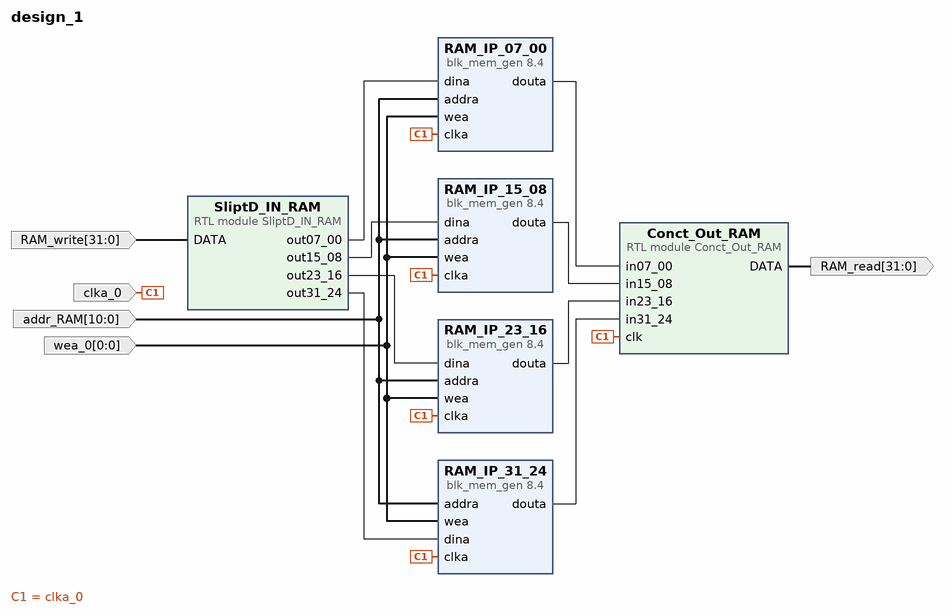
[diagram p0: block diagram of the top level]
# Vivado block design design_1, xc7z010clg400-1, Vivado 2023.2
create_bd_design design_1

create_bd_port -dir I -from 31 -to 0 RAM_write
create_bd_port -dir O -from 31 -to 0 RAM_read
create_bd_port -dir I -from 0 -to 0 wea_0
create_bd_port -dir I -type clk clka_0
create_bd_port -dir I -from 10 -to 0 addr_RAM

create_bd_cell -type module -reference Conct_Out_RAM Conct_Out_RAM
create_bd_cell -type ip -vlnv xilinx.com:ip:blk_mem_gen:8.4 RAM_IP_07_00
set_property -dict [list \
  CONFIG.Enable_32bit_Address false \
  CONFIG.Enable_A Always_Enabled \
  CONFIG.Fill_Remaining_Memory_Locations true \
  CONFIG.Operating_Mode_A READ_FIRST \
  CONFIG.Read_Width_A 8 \
  CONFIG.Register_PortA_Output_of_Memory_Primitives false \
  CONFIG.Use_Byte_Write_Enable false \
  CONFIG.Use_RSTA_Pin false \
  CONFIG.Write_Depth_A 2048 \
  CONFIG.Write_Width_A 8 \
  CONFIG.use_bram_block Stand_Alone \
] [get_bd_cells RAM_IP_07_00]
create_bd_cell -type ip -vlnv xilinx.com:ip:blk_mem_gen:8.4 RAM_IP_23_16
set_property -dict [list \
  CONFIG.Enable_32bit_Address false \
  CONFIG.Enable_A Always_Enabled \
  CONFIG.Fill_Remaining_Memory_Locations true \
  CONFIG.Operating_Mode_A READ_FIRST \
  CONFIG.Read_Width_A 8 \
  CONFIG.Register_PortA_Output_of_Memory_Primitives false \
  CONFIG.Use_Byte_Write_Enable false \
  CONFIG.Use_RSTA_Pin false \
  CONFIG.Write_Depth_A 2048 \
  CONFIG.Write_Width_A 8 \
  CONFIG.use_bram_block Stand_Alone \
] [get_bd_cells RAM_IP_23_16]
create_bd_cell -type ip -vlnv xilinx.com:ip:blk_mem_gen:8.4 RAM_IP_15_08
set_property -dict [list \
  CONFIG.Enable_32bit_Address false \
  CONFIG.Enable_A Always_Enabled \
  CONFIG.Fill_Remaining_Memory_Locations true \
  CONFIG.Operating_Mode_A READ_FIRST \
  CONFIG.Read_Width_A 8 \
  CONFIG.Register_PortA_Output_of_Memory_Primitives false \
  CONFIG.Use_Byte_Write_Enable false \
  CONFIG.Use_RSTA_Pin false \
  CONFIG.Write_Depth_A 2048 \
  CONFIG.Write_Width_A 8 \
  CONFIG.use_bram_block Stand_Alone \
] [get_bd_cells RAM_IP_15_08]
create_bd_cell -type ip -vlnv xilinx.com:ip:blk_mem_gen:8.4 RAM_IP_31_24
set_property -dict [list \
  CONFIG.Enable_32bit_Address false \
  CONFIG.Enable_A Always_Enabled \
  CONFIG.Fill_Remaining_Memory_Locations true \
  CONFIG.Operating_Mode_A READ_FIRST \
  CONFIG.Read_Width_A 8 \
  CONFIG.Register_PortA_Output_of_Memory_Primitives false \
  CONFIG.Use_Byte_Write_Enable false \
  CONFIG.Use_RSTA_Pin false \
  CONFIG.Write_Depth_A 2048 \
  CONFIG.Write_Width_A 8 \
  CONFIG.use_bram_block Stand_Alone \
] [get_bd_cells RAM_IP_31_24]
create_bd_cell -type module -reference SliptD_IN_RAM SliptD_IN_RAM

# ---- connections ----

connect_bd_net -net Conct_Out_RAM_0_DATA [get_bd_pins Conct_Out_RAM/DATA] [get_bd_ports RAM_read]
connect_bd_net -net DATA_1_1 [get_bd_ports RAM_write] [get_bd_pins SliptD_IN_RAM/DATA]
connect_bd_net [get_bd_pins RAM_IP_07_00/douta] [get_bd_pins Conct_Out_RAM/in07_00]
connect_bd_net [get_bd_pins RAM_IP_15_08/douta] [get_bd_pins Conct_Out_RAM/in15_08]
connect_bd_net [get_bd_pins RAM_IP_23_16/douta] [get_bd_pins Conct_Out_RAM/in23_16]
connect_bd_net [get_bd_pins RAM_IP_31_24/douta] [get_bd_pins Conct_Out_RAM/in31_24]
connect_bd_net -net SliptD_IN_RAM_0_out07_00 [get_bd_pins SliptD_IN_RAM/out07_00] [get_bd_pins RAM_IP_07_00/dina]
connect_bd_net -net SliptD_IN_RAM_0_out15_08 [get_bd_pins SliptD_IN_RAM/out15_08] [get_bd_pins RAM_IP_15_08/dina]
connect_bd_net -net SliptD_IN_RAM_0_out23_16 [get_bd_pins SliptD_IN_RAM/out23_16] [get_bd_pins RAM_IP_23_16/dina]
connect_bd_net -net SliptD_IN_RAM_0_out31_24 [get_bd_pins SliptD_IN_RAM/out31_24] [get_bd_pins RAM_IP_31_24/dina]
connect_bd_net -net addra_0_2 [get_bd_ports addr_RAM] \
  [get_bd_pins RAM_IP_07_00/addra] [get_bd_pins RAM_IP_23_16/addra] [get_bd_pins RAM_IP_15_08/addra] \
  [get_bd_pins RAM_IP_31_24/addra]
connect_bd_net -net clka_0_2 [get_bd_ports clka_0] \
  [get_bd_pins RAM_IP_07_00/clka] [get_bd_pins RAM_IP_23_16/clka] [get_bd_pins RAM_IP_15_08/clka] \
  [get_bd_pins RAM_IP_31_24/clka] [get_bd_pins Conct_Out_RAM/clk]
connect_bd_net -net wea_0_2 [get_bd_ports wea_0] \
  [get_bd_pins RAM_IP_07_00/wea] [get_bd_pins RAM_IP_23_16/wea] [get_bd_pins RAM_IP_15_08/wea] [get_bd_pins RAM_IP_31_24/wea]

validate_bd_design
save_bd_design
